# Altium schematic sheet JBCBJ.schdoc
size 557 x 397 mm
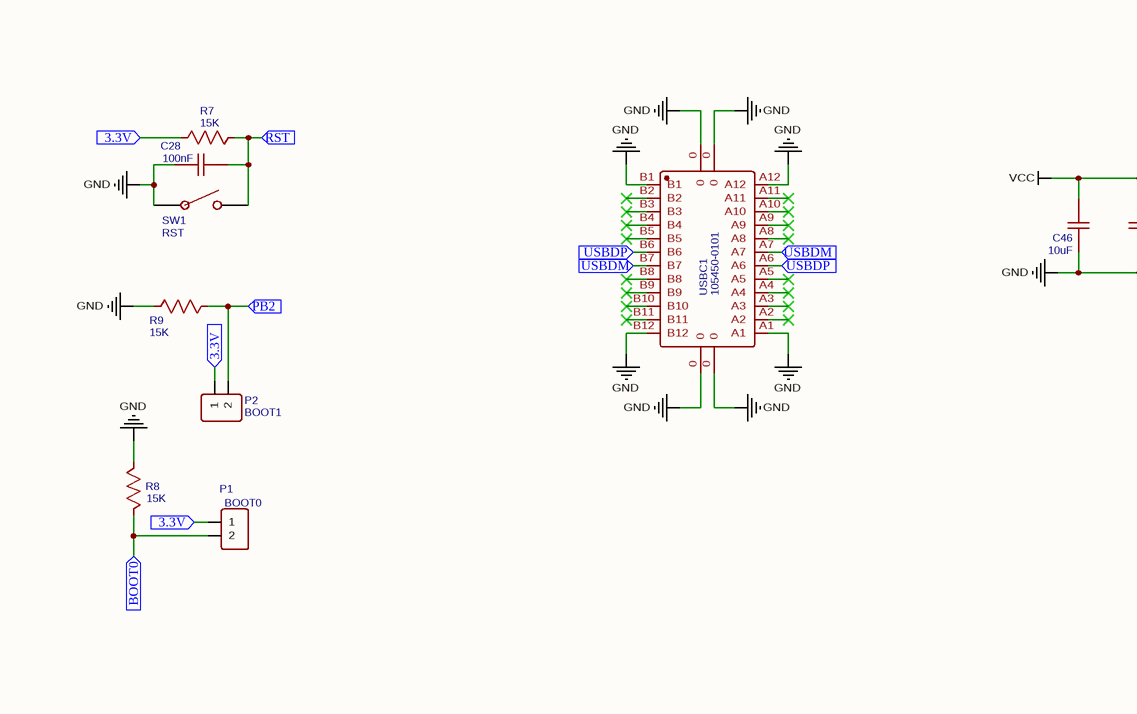
[diagram p0: JBCBJ.schdoc, top left]
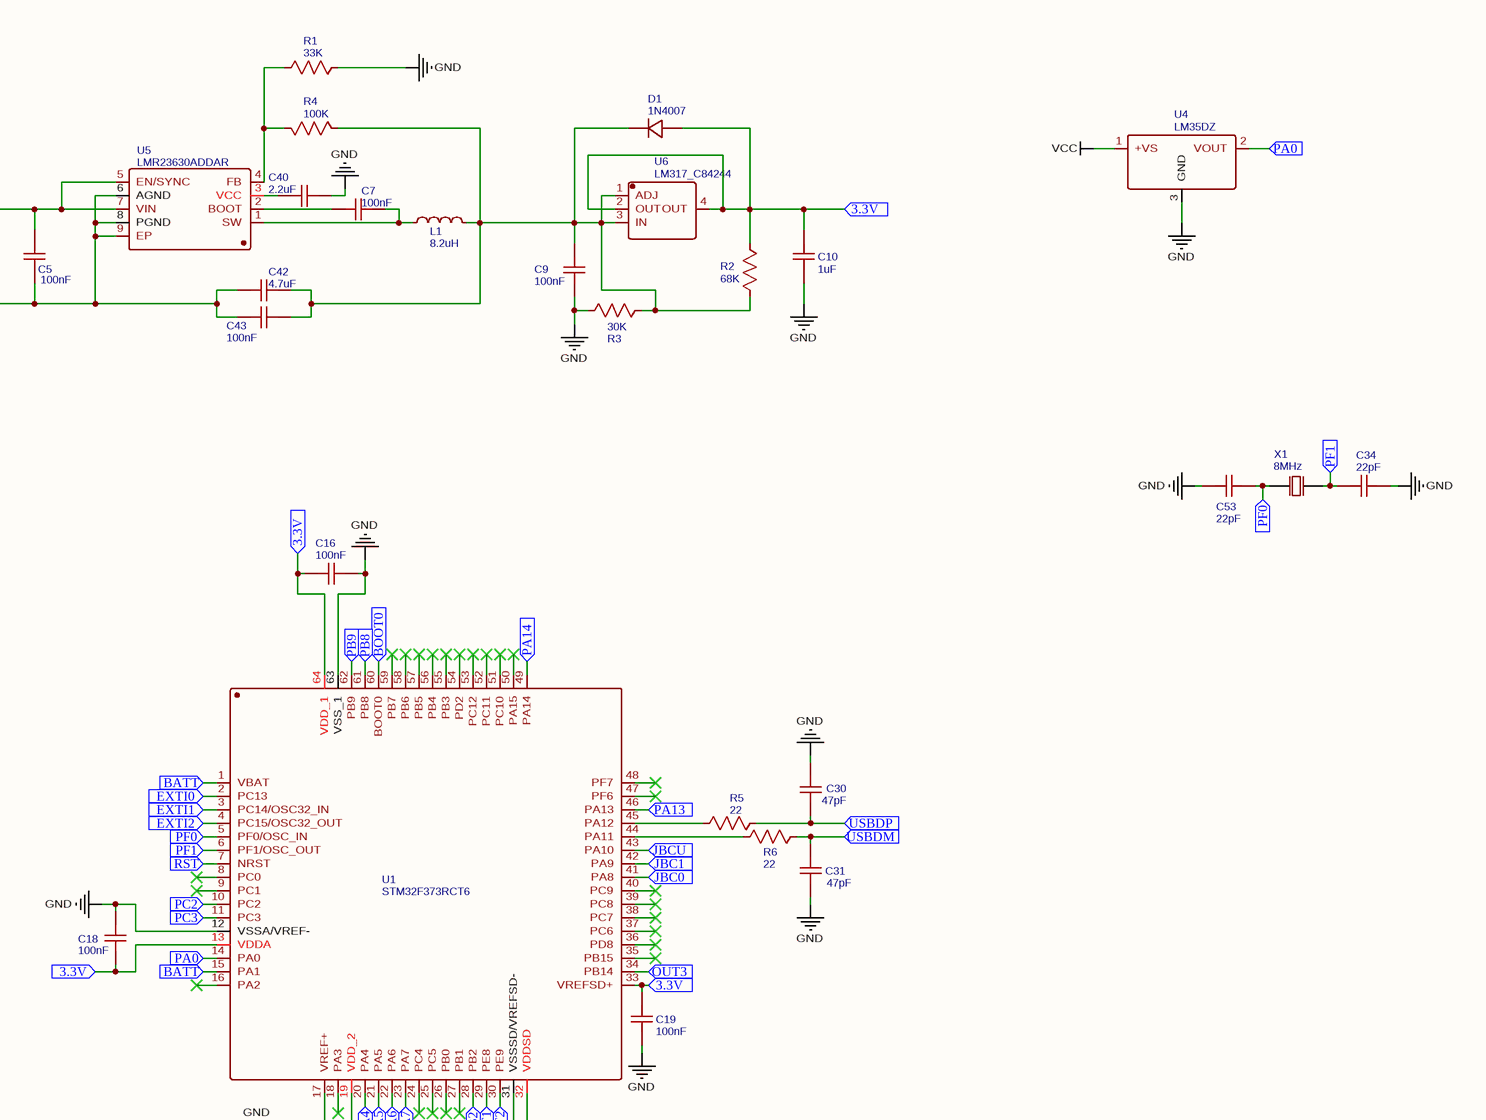
[diagram p1: JBCBJ.schdoc, top right]
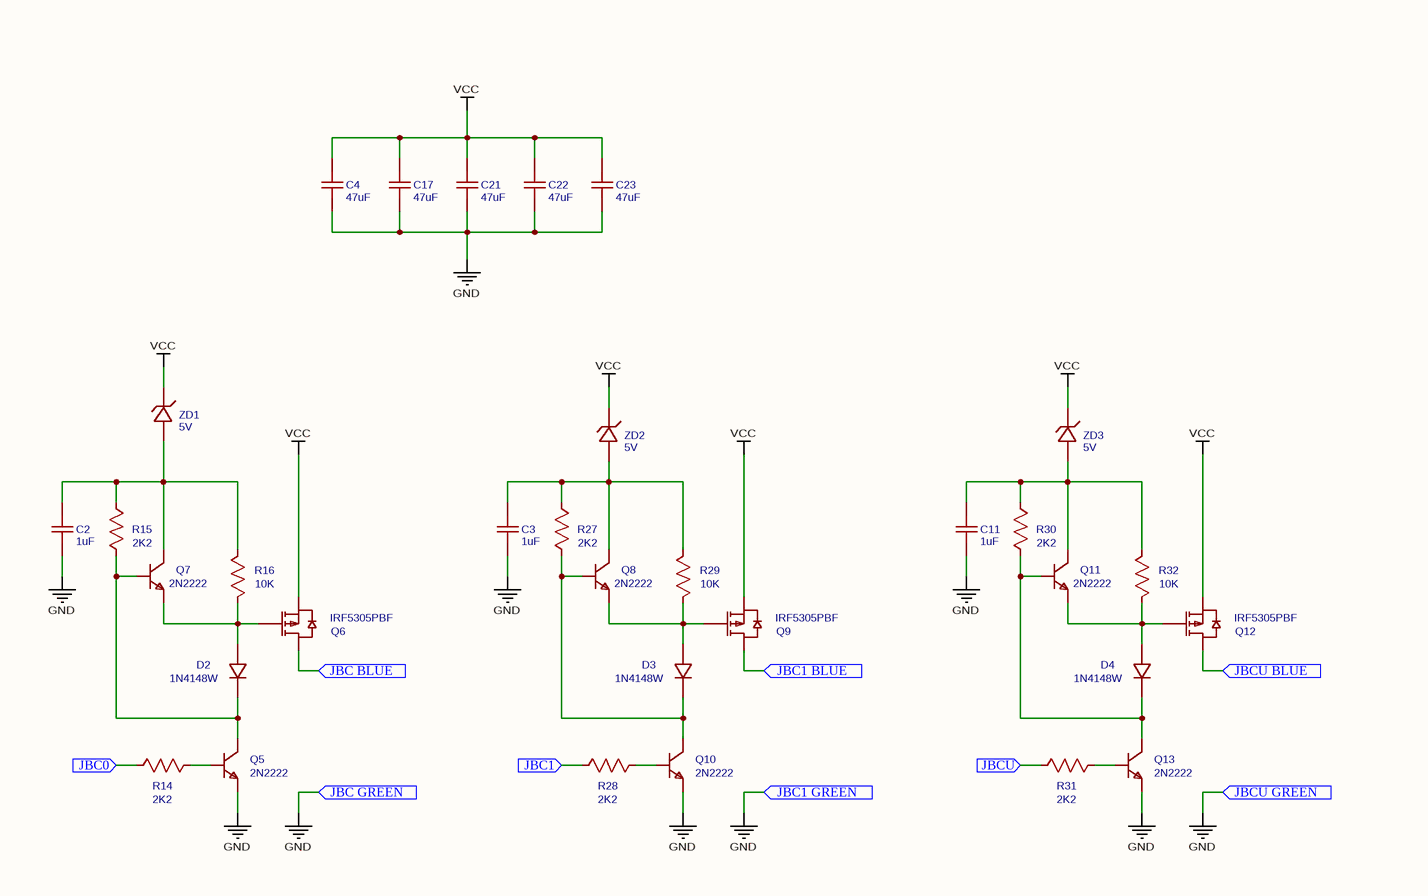
[diagram p2: JBCBJ.schdoc, bottom left]
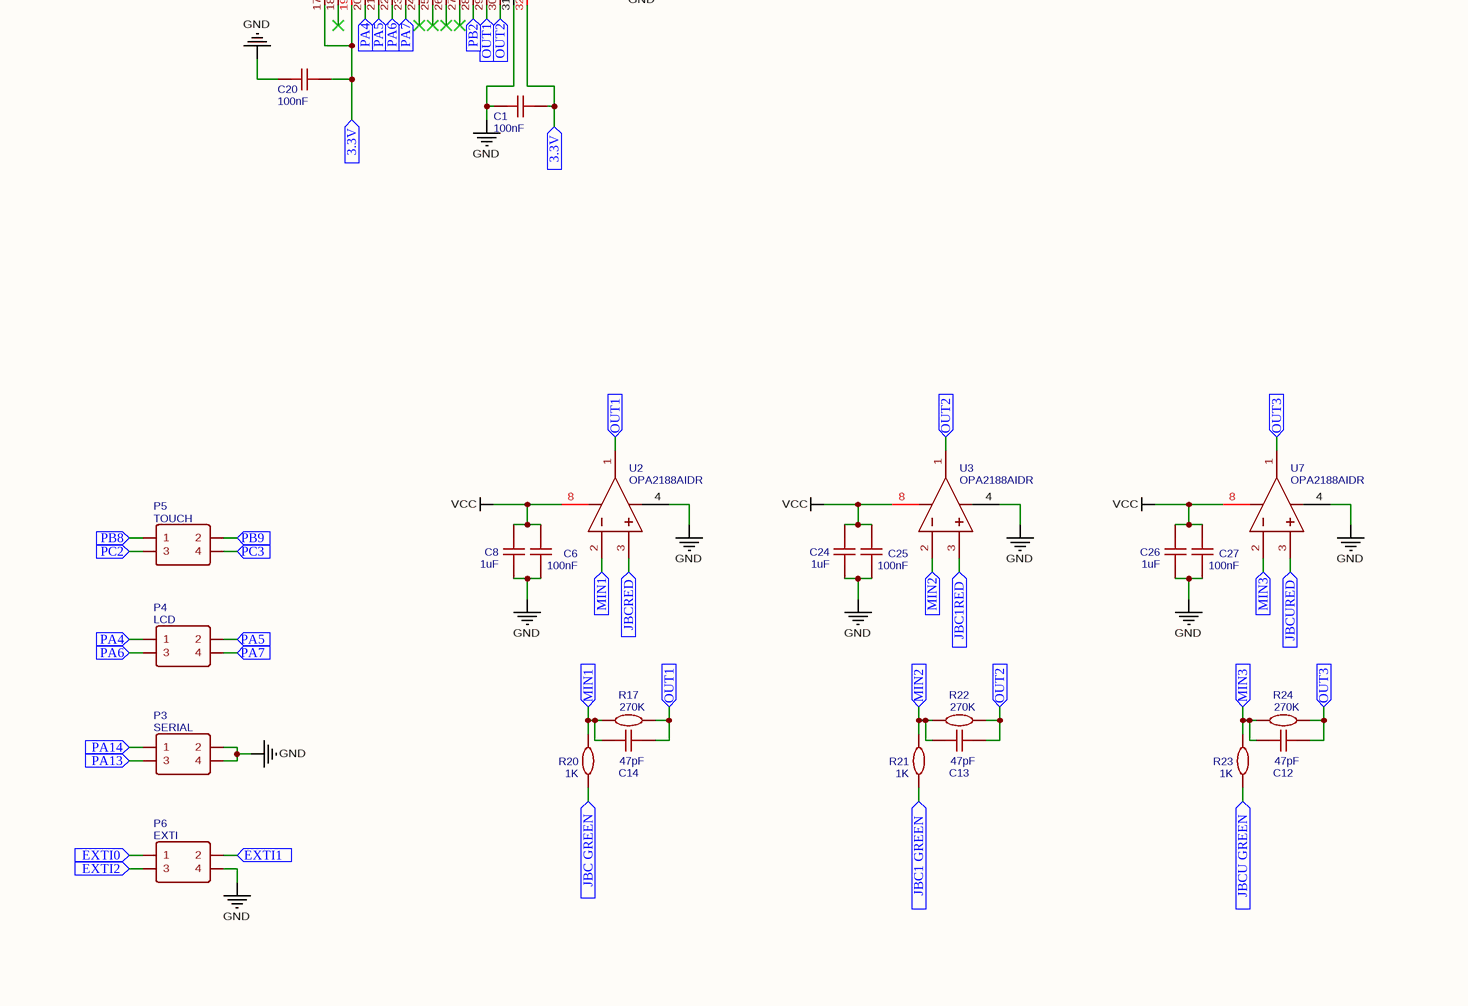
[diagram p3: JBCBJ.schdoc, bottom right]

## Parts
C1  100nF  [C0603]
C2  1uF  [C0603]
C3  1uF  [C0603]
C4  47uF  [C1206]
C5  100nF  [C0603]
C6  100nF  [C0603]
C7  100nF  [C0603]
C8  1uF  [C0603]
C9  100nF  [C0603]
C10  1uF  [C0603]
C11  1uF  [C0603]
C12  47pF  [C0603]
C13  47pF  [C0603]
C14  47pF  [C0603]
C16  100nF  [C0603]
C17  47uF  [C1206]
C18  100nF  [C0603]
C19  100nF  [C0603]
C20  100nF  [C0603]
C21  47uF  [C1206]
C22  47uF  [C1206]
C23  47uF  [C1206]
C24  1uF  [C0603]
C25  100nF  [C0603]
C26  1uF  [C0603]
C27  100nF  [C0603]
C28  100nF  [C0603]
C30  47pF  [C0603]
C31  47pF  [C0603]
C34  22pF  [C0603]
C40  2.2uF  [C0603]
C42  4.7uF  [C0603]
C43  100nF  [C0603]
C46  10uF  [C0603]
C53  22pF  [C0603]
D1  1N4007  [DO-214BA_L4.8-W2.9-LS5.3-RD]
D2  1N4148W  [SOD-323F_L2.0-W1.6-LS2.5-RD]
D3  1N4148W  [SOD-323F_L2.0-W1.6-LS2.5-RD]
D4  1N4148W  [SOD-323F_L2.0-W1.6-LS2.5-RD]
L1  8.2uH  [IND-SMD_L7.8-W7.0_MAPM0630F]
P1  BOOT0  [HDR-TH_2P-P2.54-V-M]
P2  BOOT1  [HDR-TH_2P-P2.54-V-M]
P3  SERIAL  [HDR-TH_4PIN-V-ROW2-COL2-MALE-PITCH2.54]
P4  LCD  [HDR-TH_4PIN-V-ROW2-COL2-MALE-PITCH2.54]
P5  TOUCH  [HDR-TH_4PIN-V-ROW2-COL2-MALE-PITCH2.54]
P6  EXTI  [HDR-TH_4PIN-V-ROW2-COL2-MALE-PITCH2.54]
Q5  2N2222  [SOT-23-3_L2.9-W1.3-P1.90-LS2.4-BR]
Q6  IRF5305PBF  [DPAK-3_L6.6-W6.1-P2.28-LS9.9-BR]
Q7  2N2222  [SOT-23-3_L2.9-W1.3-P1.90-LS2.4-BR]
Q8  2N2222  [SOT-23-3_L2.9-W1.3-P1.90-LS2.4-BR]
Q9  IRF5305PBF  [DPAK-3_L6.6-W6.1-P2.28-LS9.9-BR]
Q10  2N2222  [SOT-23-3_L2.9-W1.3-P1.90-LS2.4-BR]
Q11  2N2222  [SOT-23-3_L2.9-W1.3-P1.90-LS2.4-BR]
Q12  IRF5305PBF  [DPAK-3_L6.6-W6.1-P2.28-LS9.9-BR]
Q13  2N2222  [SOT-23-3_L2.9-W1.3-P1.90-LS2.4-BR]
R1  33K  [R0603]
R2  68K  [R0603]
R3  30K  [R0603]
R4  100K  [R0603]
R5  22  [R0603]
R6  22  [R0603]
R7  15K  [R0603]
R8  15K  [R0603]
R9  15K  [R0603]
R14  2K2  [R0603]
R15  2K2  [R0603]
R16  10K  [R0603]
R17  270K  [R0603]
R20  1K  [R0603]
R21  1K  [R0603]
R22  270K  [R0603]
R23  1K  [R0603]
R24  270K  [R0603]
R27  2K2  [R0603]
R28  2K2  [R0603]
R29  10K  [R0603]
R30  2K2  [R0603]
R31  2K2  [R0603]
R32  10K  [R0603]
SW1  RST  [KEY-6.0*6.0-4]
U1  STM32F373RCT6  [LQFP-64_L10.0-W10.0-P0.50-LS12.0-TL]
U2  OPA2188AIDR  [SOIC-8_L4.9-W3.9-P1.27-LS6.0-BL]
U3  OPA2188AIDR  [SOIC-8_L4.9-W3.9-P1.27-LS6.0-BL]
U4  LM35DZ  [TO-92-3_L4.9-W3.7-P1.27-L]
U5  LMR23630ADDAR  [SO-8_L4.9-W3.9-P1.27-LS6.0-BL-EP]
U6  LM317_C84244  [SOT-223-3_L6.5-W3.4-P2.30-LS7.0-BR]
U7  OPA2188AIDR  [SOIC-8_L4.9-W3.9-P1.27-LS6.0-BL]
USBC1  105450-0101  [USB-C-SMD_TYPE-C-USB-18]
X1  8MHz  [HC-49US_L11.5-W4.5-P4.88]
ZD1  5V  [VERTICAL DO41 DIODE]
ZD2  5V  [VERTICAL DO41 DIODE]
ZD3  5V  [VERTICAL DO41 DIODE]

## Ports
3.3V (in), BATT (in), BOOT0 (in), EXTI0 (in), EXTI1 (in), EXTI2 (in), JBC0 (in), JBC1 (in), JBC1 BLUE (in), JBC1 GREEN (in), JBC1RED (in), JBC BLUE (in), JBC GREEN (in), JBCRED (in), JBCU (in), JBCU BLUE (in), JBCU GREEN (in), JBCURED (in), MIN1 (in), MIN2 (in), MIN3 (in), OUT1 (in), OUT2 (in), OUT3 (in), PA0 (in), PA4 (in), PA5 (in), PA6 (in), PA7 (in), PA13 (in), PA14 (in), PB2 (in), PB8 (in), PB9 (in), PC2 (in), PC3 (in), PF0 (in), PF1 (in), RST (in), USBDM (in), USBDP (in)

## Nets
GND: C1.2 C2.1 C3.1 C4.1 C5.2 C6.2 C8.2 C9.1 C10.1 C11.1 C16.2 C17.1 C18.2 C19.2 C20.2 C21.1 C22.1 C23.1 C24.2 C25.2 C26.2 C27.2 C28.1 C30.1 C31.1 C34.2 C40.1 C42.2 C43.2 C46.2 C53.1 P3.2 P3.4 P6.4 Q5.2(E) Q10.2(E) Q13.2(E) R1.1 R3.2 R8.2 R9.2 R20.1 R21.1 R23.1 SW1.1 U1.12(VSSA/VREF-) U1.31(VSSSD/VREFSD-) U1.63(VSS_1) U2.4(V-) U3.4(V-) U4.3(GND) U5.6(AGND) U5.8(PGND) U5.9(EP) U7.4(V-) USBC1.0 USBC1.A1 USBC1.A12 USBC1.B1 USBC1.B12 ; port JBC GREEN, port JBC1 GREEN, port JBCU GREEN
VCC: C4.2 C5.1 C6.1 C8.1 C17.2 C21.2 C22.2 C23.2 C24.1 C25.1 C26.1 C27.1 C46.1 Q6.3(S) Q9.3(S) Q12.3(S) U2.8(V+) U3.8(V+) U4.1(+VS) U5.5(EN/SYNC) U5.7(VIN) U7.8(V+) ZD1.2(K) ZD2.2(K) ZD3.2(K)
3.3V: C1.1 C10.2 C16.1 C18.1 C19.1 C20.1 D1.2(A) P1.1 P2.1 R2.2 R7.1 U1.13(VDDA) U1.17(VREF+) U1.19(VDD_2) U1.32(VDDSD) U1.33(VREFSD+) U1.64(VDD_1) U6.2(OUT) U6.4(OUT) ; port 3.3V
BATT: U1.1(VBAT) U1.15(PA1) ; port BATT
BOOT0: P1.2 R8.1 U1.60(BOOT0) ; port BOOT0
EXTI0: P6.1 U1.2(PC13) ; port EXTI0
EXTI1: P6.2 U1.3(PC14/OSC32_IN) ; port EXTI1
EXTI2: P6.3 U1.4(PC15/OSC32_OUT) ; port EXTI2
JBC0: R14.1 U1.41(PA8) ; port JBC0
JBC1: R28.1 U1.42(PA9) ; port JBC1
JBC1 BLUE: Q9.2(D) ; port JBC1 BLUE
JBC1RED: U3.3(IN_A+) ; port JBC1RED
JBC BLUE: Q6.2(D) ; port JBC BLUE
JBCRED: U2.3(IN_A+) ; port JBCRED
JBCU: R31.1 U1.43(PA10) ; port JBCU
JBCU BLUE: Q12.2(D) ; port JBCU BLUE
JBCURED: U7.3(IN_A+) ; port JBCURED
MIN1: C14.1 R17.2 R20.2 U2.2(IN_A-) ; port MIN1
MIN2: C13.1 R21.2 R22.2 U3.2(IN_A-) ; port MIN2
MIN3: C12.1 R23.2 R24.2 U7.2(IN_A-) ; port MIN3
OUT1: C14.2 R17.1 U1.29(PE8) U2.1(OUT_A) ; port OUT1
OUT2: C13.2 R22.1 U1.30(PE9) U3.1(OUT_A) ; port OUT2
OUT3: C12.2 R24.1 U1.34(PB14) U7.1(OUT_A) ; port OUT3
PA0: U1.14(PA0) U4.2(VOUT) ; port PA0
PA4: P4.1 U1.20(PA4) ; port PA4
PA5: P4.2 U1.21(PA5) ; port PA5
PA6: P4.3 U1.22(PA6) ; port PA6
PA7: P4.4 U1.23(PA7) ; port PA7
PA13: P3.3 U1.46(PA13) ; port PA13
PA14: P3.1 U1.49(PA14) ; port PA14
PB2: P2.2 R9.1 U1.28(PB2) ; port PB2
PB8: P5.1 U1.61(PB8) ; port PB8
PB9: P5.2 U1.62(PB9) ; port PB9
PC2: P5.3 U1.10(PC2) ; port PC2
PC3: P5.4 U1.11(PC3) ; port PC3
PF0: C53.2 U1.5(PF0/OSC_IN) X1.1(OSC1) ; port PF0
PF1: C34.1 U1.6(PF1/OSC_OUT) X1.2(OSC2) ; port PF1
RST: C28.2 R7.2 SW1.2 U1.7(NRST) ; port RST
USBDM: C31.2 R6.2 USBC1.A7 USBC1.B7 ; port USBDM
USBDP: C30.2 R5.2 USBC1.A6 USBC1.B6 ; port USBDP
NetC2_2: C2.2 Q7.3(C) R15.2 R16.1 ZD1.1(A)
NetC3_2: C3.2 Q8.3(C) R27.2 R29.1 ZD2.1(A)
NetC7_1: C7.1 L1.2 U5.1(SW)
NetC7_2: C7.2 U5.2(BOOT)
NetC9_2: C9.2 C42.1 C43.1 D1.1(K) L1.1 R2.1 R3.1 R4.2 U6.1(ADJ) U6.3(IN)
NetC11_2: C11.2 Q11.3(C) R30.2 R32.1 ZD3.1(A)
NetC40_2: C40.2 U5.3(VCC)
NetD2_1: D2.1 Q5.3(C) Q7.1(B) R15.1
NetD2_2: D2.2 Q6.1(G) Q7.2(E) R16.2
NetD3_1: D3.1 Q8.1(B) Q10.3(C) R27.1
NetD3_2: D3.2 Q8.2(E) Q9.1(G) R29.2
NetD4_1: D4.1 Q11.1(B) Q13.3(C) R30.1
NetD4_2: D4.2 Q11.2(E) Q12.1(G) R32.2
NetQ5_1: Q5.1(B) R14.2
NetQ10_1: Q10.1(B) R28.2
NetQ13_1: Q13.1(B) R31.2
NetR1_2: R1.2 R4.1 U5.4(FB)
NetR5_1: R5.1 U1.45(PA12)
NetR6_1: R6.1 U1.44(PA11)

Not connected (* = marked no-connect by the designer): U1 8(PC0)* 9(PC1)* 16(PA2)* 18(PA3)* 24(PC4)* 25(PC5)* 26(PB0)* 27(PB1)* 35(PB15)* 36(PD8)* 37(PC6)* 38(PC7)* 39(PC8)* 40(PC9)* 47(PF6)* 48(PF7)* 50(PA15)* 51(PC10)* 52(PC11)* 53(PC12)* 54(PD2)* 55(PB3)* 56(PB4)* 57(PB5)* 58(PB6)* 59(PB7)*; USBC1 A2* A3* A4* A5* A8* A9* A10* A11* B2* B3* B4* B5* B8* B9* B10* B11*

## Library data of the parts
C1 C5-C7 C9 C16 C18-C20 C25 C27 C28 C43 = 100nF: nameAlias: Value(F); spicePre: C; spiceSymbolName: Cap_RAD-0.1_US
C2 C3 C11 = 1uF: nameAlias: Value(F); Contributor: LCEDA_Lib; spicePre: C; spiceSymbolName: C_0201_US
C4 C17 C21-C23 = 47uF: nameAlias: Value(F); Contributor: LCEDA_Lib; spicePre: C; spiceSymbolName: C_0201_US
C8 C10 C24 C26 = 1uF: nameAlias: Value(F); spicePre: C; spiceSymbolName: Cap_RAD-0.1_US
C12-C14 C30 C31 = 47pF: nameAlias: Value(F); spicePre: C; spiceSymbolName: Cap_RAD-0.1_US
C34 C53 = 22pF: nameAlias: Value(F); spicePre: C; spiceSymbolName: Cap_RAD-0.1_US
C40 = 2.2uF: nameAlias: Value(F); spicePre: C; spiceSymbolName: Cap_RAD-0.1_US
C42 = 4.7uF: nameAlias: Value(F); spicePre: C; spiceSymbolName: Cap_RAD-0.1_US
C46 = 10uF: nameAlias: Value(F); spicePre: C; spiceSymbolName: Cap_RAD-0.1_US
D1 = 1N4007: BOM_Manufacturer: SEMTECH; BOM_Supplier: LCSC; BOM_Manufacturer Part: 1N4007; BOM_Supplier Part: C106903; spicePre: D; spiceSymbolName: 1N4007
D2-D4 = 1N4148W: BOM_Manufacturer: Tak Cheong; Contributor: LCEDA_Lib; BOM_Supplier: LCSC; BOM_Manufacturer Part: 1N4148W; BOM_Supplier Part: C129216; spicePre: D; spiceSymbolName: 1N4148W
L1 = 8.2uH: BOM_Manufacturer: microgate; BOM_Manufacturer Part: MAPM0630F-8R2M-LF; nameAlias: Inductance; Contributor: LCSC; BOM_Supplier: LCSC; BOM_Supplier Part: C280926; spicePre: L; spiceSymbolName: MAPM0630F-8R2M-LF
P1 = BOOT0: BOM_Manufacturer: BOOMELE; BOM_Manufacturer Part: 2.54-1*2PFemale; BOM_Supplier: LCSC; image: //image.lceda.cn/szlcsc/C49661.jpg; BOM_Supplier Part: C49661; spicePre: P; spiceSymbolName: Header-Female-2.54_1x2
P2 = BOOT1: BOM_Manufacturer: BOOMELE; BOM_Manufacturer Part: 2.54-1*2PFemale; BOM_Supplier: LCSC; image: //image.lceda.cn/szlcsc/C49661.jpg; BOM_Supplier Part: C49661; spicePre: P; spiceSymbolName: Header-Female-2.54_1x2
P3 = SERIAL: BOM_Manufacturer: BOOMELE; BOM_Manufacturer Part: Double Rows2.54mm2*2pHeaders  Pins; BOM_Supplier: LCSC; BOM_Supplier Part: C66690; spicePre: P; spiceSymbolName: Header-Male-2.54_2x2
P4 = LCD: BOM_Manufacturer: BOOMELE; BOM_Manufacturer Part: Double Rows2.54mm2*2pHeaders  Pins; BOM_Supplier: LCSC; BOM_Supplier Part: C66690; spicePre: P; spiceSymbolName: Header-Male-2.54_2x2
P5 = TOUCH: BOM_Manufacturer: BOOMELE; BOM_Manufacturer Part: Double Rows2.54mm2*2pHeaders  Pins; BOM_Supplier: LCSC; BOM_Supplier Part: C66690; spicePre: P; spiceSymbolName: Header-Male-2.54_2x2
P6 = EXTI: BOM_Manufacturer: BOOMELE; BOM_Manufacturer Part: Double Rows2.54mm2*2pHeaders  Pins; BOM_Supplier: LCSC; BOM_Supplier Part: C66690; spicePre: P; spiceSymbolName: Header-Male-2.54_2x2
Q5 Q10 Q13 = 2N2222: BOM_Manufacturer: SEMTECH; BOM_Manufacturer Part: 2N3904; BOM_Supplier: LCSC; BOM_Supplier Part: C118538; spicePre: Q; spiceSymbolName: 2N3904
Q6 Q9 Q12 = IRF5305PBF: BOM_Manufacturer: IR; BOM_Supplier: LCSC; BOM_Manufacturer Part: IRF5305PBF; image: //image.lceda.cn/szlcsc/C2623.jpg; BOM_Supplier Part: C2623; spicePre: Q; spiceSymbolName: IRF5305PBF
Q7 Q8 Q11 = 2N2222: BOM_Manufacturer: SEMTECH; Contributor: LCSC; BOM_Supplier: LCSC; BOM_Manufacturer Part: 2N2222; BOM_Supplier Part: C118536; spicePre: Q; spiceSymbolName: 2N2222
R1 = 33K: nameAlias: Value(Ω); spicePre: R; spiceSymbolName: Res_AXIAL-0.3(1/8W)_US
R2 = 68K: nameAlias: Value(Ω); spicePre: R; spiceSymbolName: Res_AXIAL-0.3(1/8W)_US
R3 = 30K: nameAlias: Value(Ω); spicePre: R; spiceSymbolName: Res_AXIAL-0.3(1/8W)_US
R4 = 100K: nameAlias: Value(Ω); spicePre: R; spiceSymbolName: Res_AXIAL-0.3(1/8W)_US
R5 R6 = 22: nameAlias: Value(Ω); spicePre: R; spiceSymbolName: Res_AXIAL-0.3(1/8W)_US
R7-R9 = 15K: nameAlias: Value(Ω); spicePre: R; spiceSymbolName: Res_AXIAL-0.3(1/8W)_US
R14 R15 R27 R28 R30 R31 = 2K2: nameAlias: Value(Ω); Contributor: LCEDA_Lib; spicePre: R; spiceSymbolName: R_0201_US
R16 R29 R32 = 10K: nameAlias: Value(Ω); spicePre: R; spiceSymbolName: Res_AXIAL-0.3(1/8W)_US
R17 R22 R24 = 270K: BOM_Manufacturer: ResistorToday; BOM_Manufacturer Part: PTFR0805B270KN9; nameAlias: Resistance (Ohms); Contributor: LCSC; BOM_Supplier: LCSC; BOM_Supplier Part: C351588; spicePre: R; spiceSymbolName: PTFR0805B270KN9
R20 R21 R23 = 1K: BOM_Manufacturer: PANASONIC; BOM_Manufacturer Part: ERA-6AEB102V; nameAlias: Resistance (Ohms); Contributor: LCSC; BOM_Supplier: LCSC; BOM_Supplier Part: C192073; spicePre: R; spiceSymbolName: ERA-6AEB102V
SW1 = RST: BOM_Manufacturer: PANASONIC; BOM_Manufacturer Part: EVQ22705R; Contributor: LCSC; BOM_Supplier: LCSC; BOM_Supplier Part: C79156; spicePre: S; spiceSymbolName: EVQ22705R
U1 = STM32F373RCT6: BOM_Manufacturer: STMicroelectronics; SMT Type: Extend; BOM_Supplier: LCSC; BOM_Manufacturer Part: STM32F373RCT6; BOM_Supplier Part: C84174; BOM_LCSC Assembly: Yes; spicePre: U; spiceSymbolName: STM32F373RCT6
U2 U3 U7 = OPA2188AIDR: BOM_Manufacturer: TI; subpart_no: 1; tags: Precision Operational Amplifier; BOM_Supplier Part: C17271; BOM_Supplier: LCSC; BOM_Manufacturer Part: OPA2188AIDR; image: http://image.lceda.cn/szlcsc/C17271.jpg; spicePre: U; spiceSymbolName: OPA2188AIDR
U4 = LM35DZ: BOM_Manufacturer: TI; BOM_Supplier: LCSC; BOM_Manufacturer Part: LM35DZ; image: //image.lceda.cn/szlcsc/C12165.jpg; BOM_Supplier Part: C12165; spicePre: U; spiceSymbolName: LM35DZ
U5 = LMR23630ADDAR: BOM_Manufacturer: Texas Instruments; Contributor: LCSC; BOM_Supplier: LCSC; BOM_Supplier Part: C477923; BOM_Manufacturer Part: LMR23630ADDAR; spicePre: U; spiceSymbolName: LMR23630ADDAR
U6 = LM317_C84244: BOM_Manufacturer: CJ; BOM_Manufacturer Part: LM317; SMT Type: Extend; BOM_Supplier: LCSC; BOM_Supplier Part: C84244; BOM_LCSC Assembly: Yes; spicePre: U; spiceSymbolName: LM317_C84244
USBC1 = 105450-0101: BOM_Manufacturer: MOLEX; Contributor: LCSC; BOM_Supplier: LCSC; BOM_Supplier Part: C134092; BOM_Manufacturer Part: 105450-0101; spicePre: U; spiceSymbolName: 105450-0101
X1 = 8MHz: BOM_Manufacturer: Yangxing Tech; BOM_Manufacturer Part: X49SD8MSB2SI; nameAlias: Frequency; Contributor: LCSC; BOM_Supplier: LCSC; BOM_Supplier Part: C188205; spicePre: X; spiceSymbolName: X49SD8MSB2SI
ZD1-ZD3 = 5V: BOM_Manufacturer Part: BZX84C5V1; BOM_Manufacturer: CJ; SMT Type: Extend; BOM_Supplier: LCSC; image: //image.lceda.cn/szlcsc/C27131.jpg; BOM_Supplier Part: C27131; BOM_LCSC Assembly: Yes; spicePre: Z; spiceSymbolName: BZX84C5V1